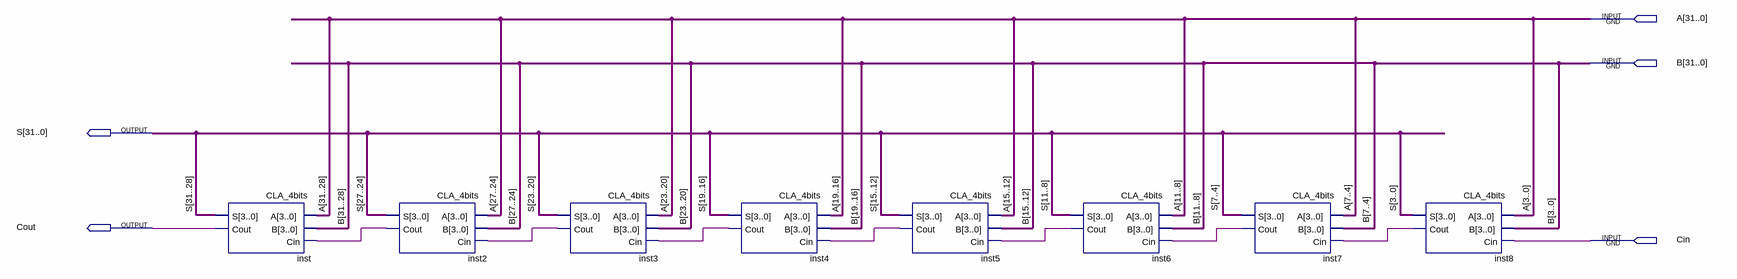
[diagram p0: schematic sheet]
// Quartus schematic CLA_32bits.bdf as structural Verilog: 8 symbols, 5 pins
module CLA_32bits (
  input  [31:0] A,
  input  [31:0] B,
  input  Cin,
  output [31:0] S,
  output Cout
);

  wire inst2_cout, inst3_cout, inst4_cout, inst5_cout, inst6_cout, inst7_cout, inst8_cout;

  CLA_4bits inst (.A(A[31:28]), .B(B[31:28]), .Cin(inst2_cout), .S(S[31:28]), .Cout(Cout));
  CLA_4bits inst2 (.A(A[27:24]), .B(B[27:24]), .Cin(inst3_cout), .S(S[27:24]), .Cout(inst2_cout));
  CLA_4bits inst3 (.A(A[23:20]), .B(B[23:20]), .Cin(inst4_cout), .S(S[23:20]), .Cout(inst3_cout));
  CLA_4bits inst4 (.A(A[19:16]), .B(B[19:16]), .Cin(inst5_cout), .S(S[19:16]), .Cout(inst4_cout));
  CLA_4bits inst5 (.A(A[15:12]), .B(B[15:12]), .Cin(inst6_cout), .S(S[15:12]), .Cout(inst5_cout));
  CLA_4bits inst6 (.A(A[11:8]), .B(B[11:8]), .Cin(inst7_cout), .S(S[11:8]), .Cout(inst6_cout));
  CLA_4bits inst7 (.A(A[7:4]), .B(B[7:4]), .Cin(inst8_cout), .S(S[7:4]), .Cout(inst7_cout));
  CLA_4bits inst8 (.A(A[3:0]), .B(B[3:0]), .Cin(Cin), .S(S[3:0]), .Cout(inst8_cout));
endmodule
